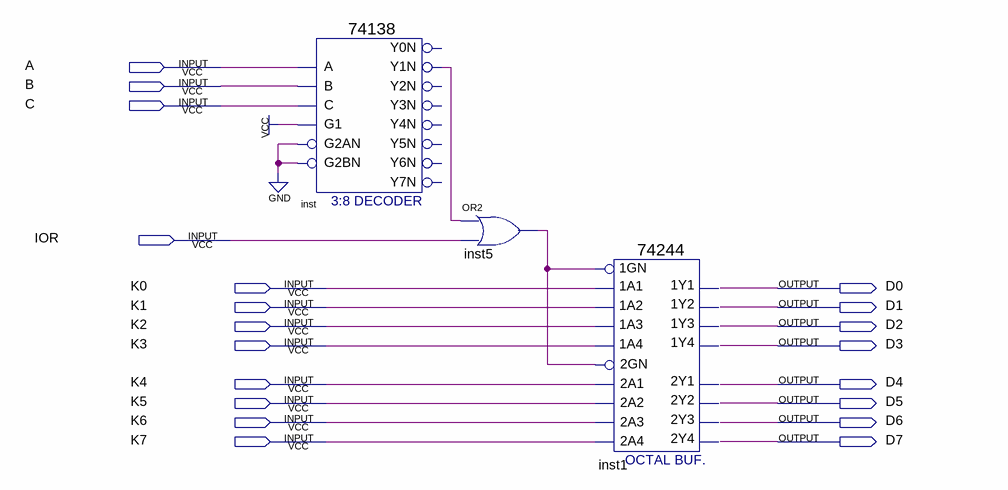
[diagram p0: schematic sheet]
// Quartus schematic project2.bdf as structural Verilog: 3 symbols, 20 pins
module project2 (
  input  A,
  input  B,
  input  C,
  input  IOR,
  input  K0,
  input  K1,
  input  K2,
  input  K3,
  input  K4,
  input  K5,
  input  K6,
  input  K7,
  output D0,
  output D1,
  output D2,
  output D3,
  output D4,
  output D5,
  output D6,
  output D7
);

  wire inst5_out, inst_y1n;

  \74138  inst (
    .A(A), .B(B), .G1(1'b1), .C(C), .G2AN(1'b0), .G2BN(1'b0), .Y1N(inst_y1n));  // open: Y0N, Y2N, Y3N, Y4N, Y5N, Y6N, Y7N
  or inst5 (inst5_out, inst_y1n, IOR);
  \74244  inst1 (
    .\1A2 (K1), .\1A4 (K3), .\1A1 (K0), .\1A3 (K2), .\1GN (inst5_out), .\2A3 (K6), .\2GN (inst5_out),
    .\2A1 (K4), .\2A4 (K7), .\2A2 (K5), .\1Y2 (D1), .\1Y4 (D3), .\2Y1 (D4), .\1Y1 (D0), .\2Y3 (D6),
    .\2Y4 (D7), .\1Y3 (D2), .\2Y2 (D5));
endmodule
